# Altium schematic sheet RemoteSch_V2.SchDoc: Remote Controller
size A3; Author: Neil Patil, Harris Tomy; Organization: The University of Auckland; Address1: Building 405; Address2: 20 Symonds Street; Address3: Auckland, 1010; Address4: New Zealand; Revision: 1R0; SheetNumber: 1; SheetTotal: ?
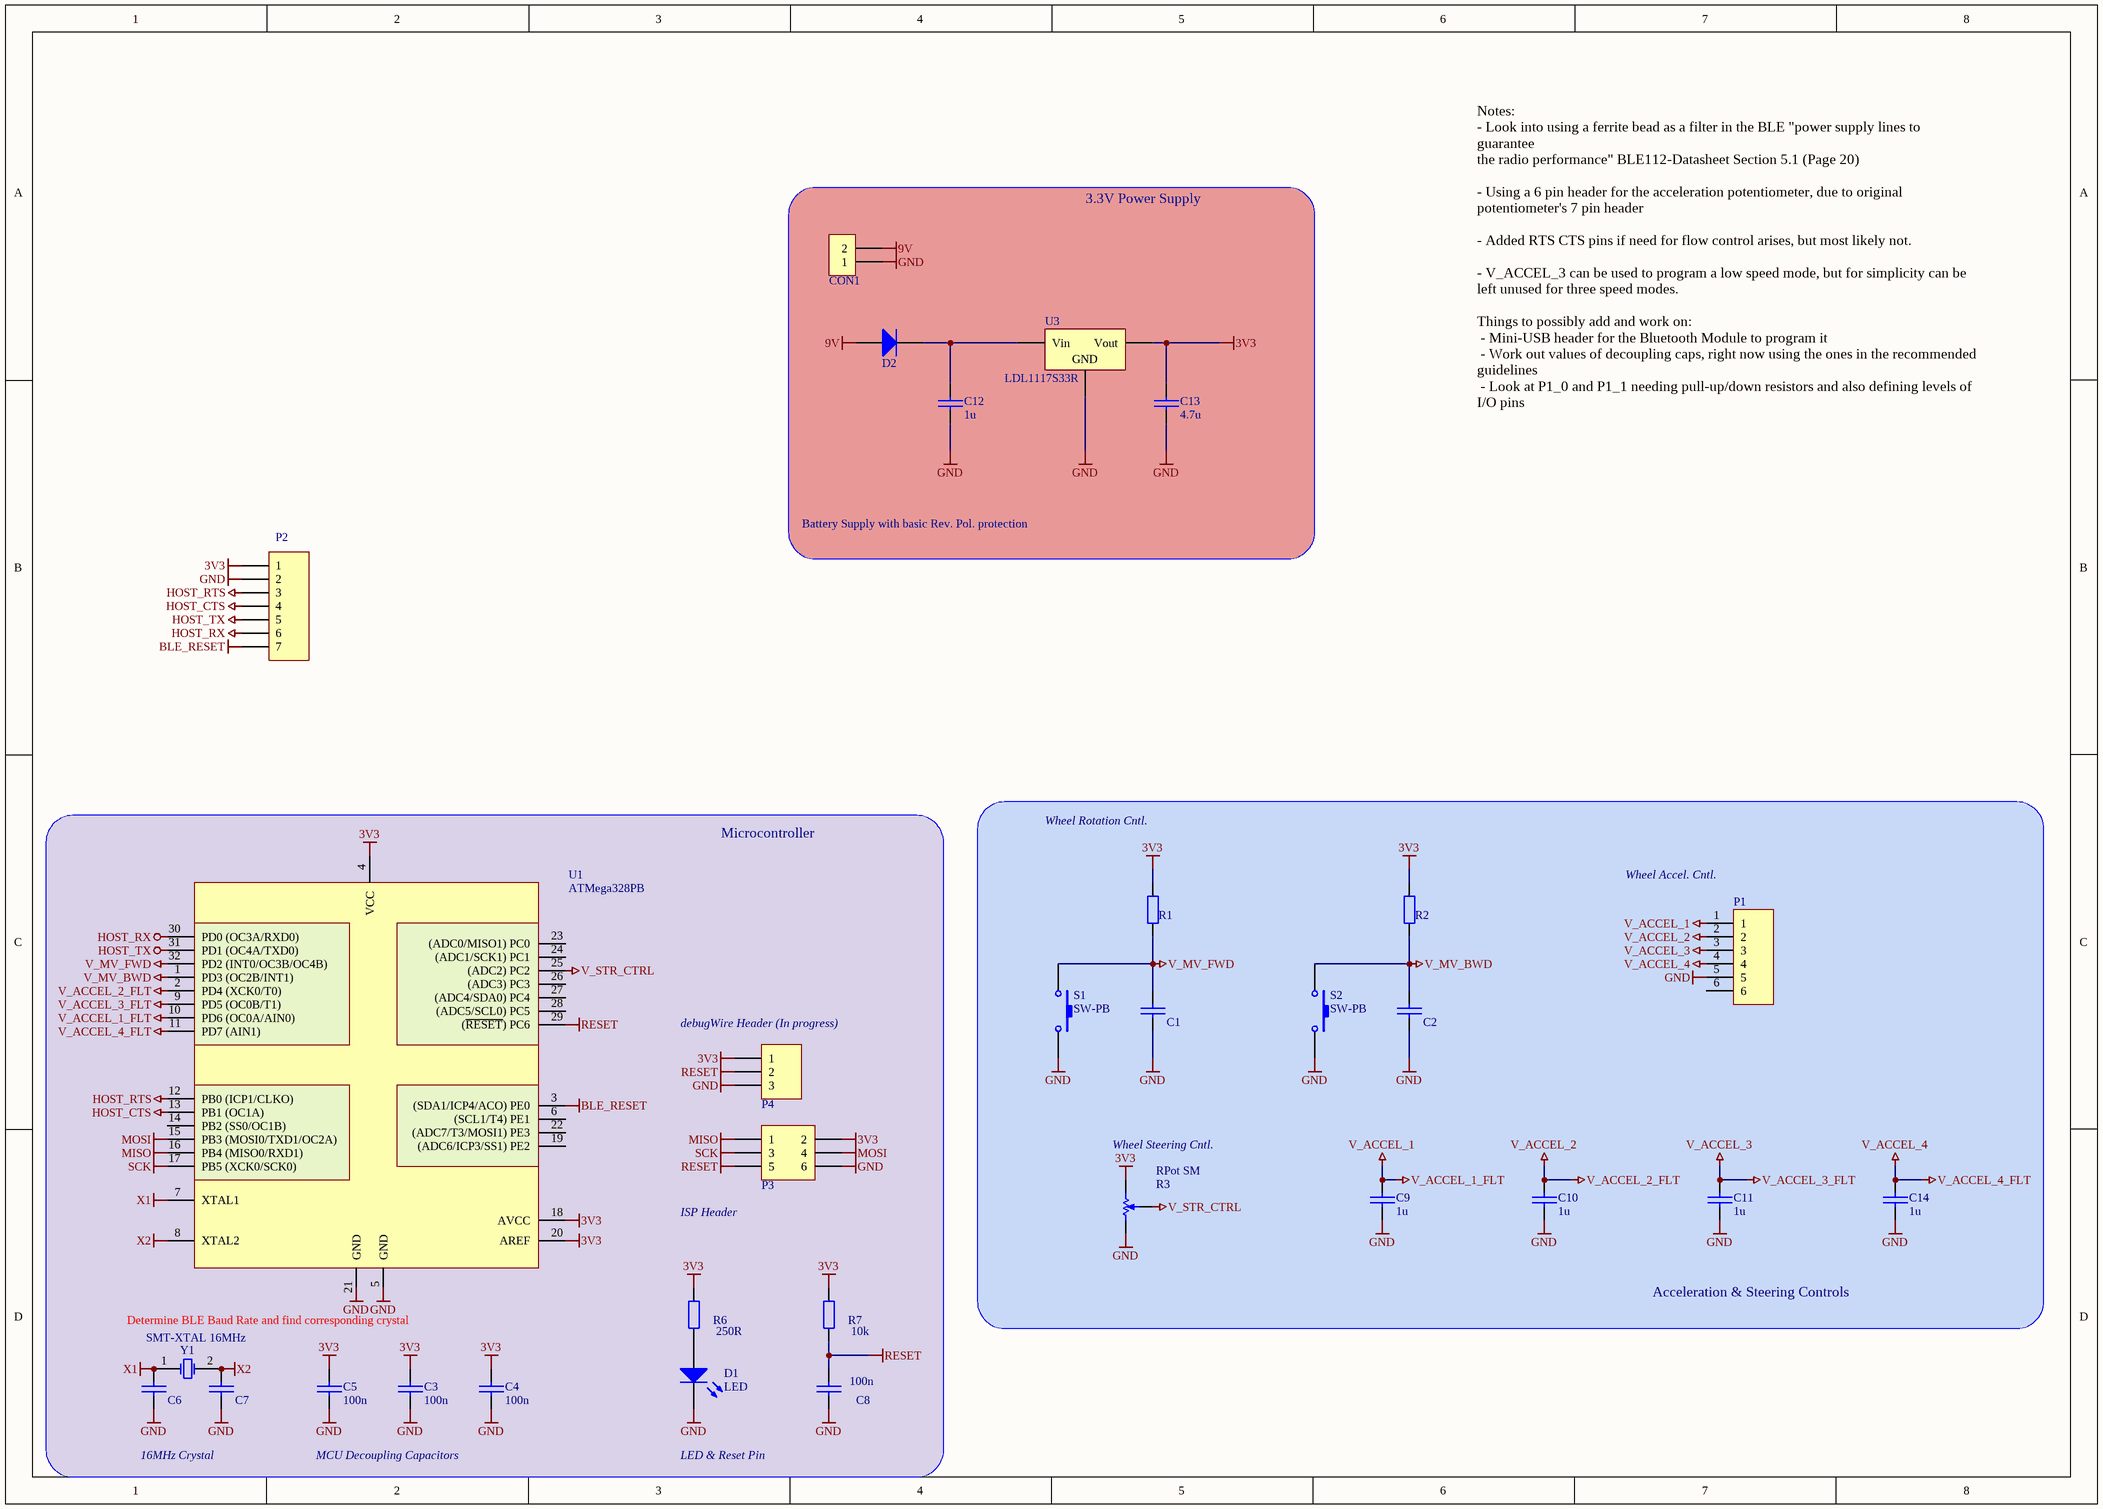
[diagram p0: RemoteSch_V2.SchDoc]

## Parts
C1  Capacitor 0805  [C0805]  (value not drawn)
C2  Capacitor 0805  [C0805]  (value not drawn)
C3  100n  [C1206]
C4  100n  [C1206]
C5  100n  [C1206]
C6  CCAP1210  [C1210]  (value not drawn)
C7  CCAP1210  [C1210]  (value not drawn)
C8  100n  [C1210]
C9  1u  [C0805]
C10  1u  [C0805]
C11  1u  [C0805]
C12  1u  [C1210]
C13  4.7u  [C1210]
C14  1u  [C0805]
CON1  Header 2X1  [HDR2X1_2P54]  (value not drawn)
D1  LED  [R0805]
D2  Diode  [DAX4]  (value not drawn)
P1  Header 6X1  [HDR6X1_2P54]  (value not drawn)
P2  Header 7  [HDR1X7]  (value not drawn)
P3  HDR3X2  [HDR2X3_2P54]  (value not drawn)
P4  Header 3  [HDR1X3]  (value not drawn)
R1  Resistor 0805  [R0805]  (value not drawn)
R2  Resistor 0805  [R0805]  (value not drawn)
R3  RPot SM  [POT4MM-2]
R6  250R  [R1206]
R7  10k  [R1206]
S1  SW-PB  [SPST-2]
S2  SW-PB  [SPST-2]
U1  ATMega328PB  [TQFP32]
U3  LDL1117S33R  [SOT223L]
Y1  SMT-XTAL 16MHz  [HC49-US]

## Blocks framed on the sheet
3.3V Power Supply: C12 C13 CON1 D2 U3
Microcontroller: C3-C8 D1 P3 P4 R6 R7 U1 Y1
Acceleration & Steering Controls: C1 C2 C9-C11 C14 P1 R1-R3 S1 S2

## Nets
3V3: C3.2 C4.2 C5.2 C13.2 P2.1 P3.2 P4.1 R1.1 R2.1 R3.CW(+) R6.2 R7.2 U1.4(VCC) U1.18(AVCC) U1.20(AREF) U3.2(Vout)
9V: CON1.2 D2.1
BLE_RESET: P2.7 U1.3((SDA1/ICP4/ACO)_PE0)
GND: C1.1 C2.1 C3.1 C4.1 C5.1 C6.1 C7.1 C8.1 C9.1 C10.1 C11.1 C12.1 C13.1 C14.1 CON1.1 D1.2(K) P1.5 P2.2 P3.6 P4.3 R3.CCW(-) S1.2 S2.2 U3.1(GND)
HOST_CTS: P2.4 U1.13(PB1_(OC1A))
HOST_RTS: P2.3 U1.12(PB0_(ICP1/CLKO))
HOST_RX: P2.6 U1.30(PD0_(OC3A/RXD0))
HOST_TX: P2.5 U1.31(PD1_(OC4A/TXD0))
MISO: P3.1 U1.16(PB4_(MISO0/RXD1))
MOSI: P3.4 U1.15(PB3_(MOSI0/TXD1/OC2A))
RESET: C8.2 P3.5 P4.2 R7.1 U1.29((~{RESET})_PC6)
SCK: P3.3 U1.17(PB5_(XCK0/SCK0))
V_ACCEL_1: C9.2 P1.1 U1.10(PD6_(OC0A/AIN0))  [also labelled V_ACCEL_1_FLT]
V_ACCEL_2: C10.2 P1.2 U1.2(PD4_(XCK0/T0))  [also labelled V_ACCEL_2_FLT]
V_ACCEL_3: C11.2 P1.3 U1.9(PD5_(OC0B/T1))  [also labelled V_ACCEL_3_FLT]
V_ACCEL_4: C14.2 P1.4 U1.11(PD7_(AIN1))  [also labelled V_ACCEL_4_FLT]
V_MV_BWD: C2.2 R2.2 S2.1 U1.1(PD3_(OC2B/INT1))
V_MV_FWD: C1.2 R1.2 S1.1 U1.32(PD2_(INT0/OC3B/OC4B))
V_STR_CTRL: R3.W U1.25((ADC2)_PC2)
X1: C6.2 U1.7(XTAL1) Y1.1(OSC1)
X2: C7.2 U1.8(XTAL2) Y1.2(OSC2)
NetC12_2: C12.2 D2.2 U3.3(Vin)
NetD1_1: D1.1(A) R6.1

Not connected (* = marked no-connect by the designer): P1 6; U1 5(GND) 6((SCL1/T4)_PE1) 14(PB2_(SS0/OC1B)) 19((ADC6/ICP3/SS1)_PE2) 21(GND) 22((ADC7/T3/MOSI1)_PE3) 23((ADC0/MISO1)_PC0) 24((ADC1/SCK1)_PC1) 26((ADC3)_PC3) 27((ADC4/SDA0)_PC4) 28((ADC5/SCL0)_PC5)

## Notes on the sheet
- Notes:
  - Look into using a ferrite bead as a filter in the BLE "power supply lines to guarantee
  the radio performance" BLE112-Datasheet Section 5.1 (Page 20)
  - Using a 6 pin header for the acceleration potentiometer, due to original potentiometer's 7 pin header
  - Added RTS CTS pins if need for flow control arises, but most likely not.
  - V_ACCEL_3 can be used to program a low speed mode, but for simplicity can be left unused for three speed modes.
  Things to possibly add and work on:
  - Mini-USB header for the Bluetooth Module to program it
  - Work out values of decoupling caps, right now using the ones in the recommended guidelines
  - Look at P1_0 and P1_1 needing pull-up/down resistors and also defining levels of I/O pins
- Battery Supply with basic Rev. Pol. protection
- Wheel Rotation Cntl.
- (near P1) Wheel Accel. Cntl.
- (near P4) debugWire Header (In progress)
- (near R3) Wheel Steering Cntl.
- (near P3) ISP Header
- Determine BLE Baud Rate and find corresponding crystal
- 16MHz Crystal
- MCU Decoupling Capacitors
- LED & Reset Pin
- Labels drawn without touching a wire or pin: GND
- Title:
- Author:
- Date:
- Time:
- Revision:
- Sheet
- of
- File:

## Library data of the parts
C1 C2 C9-C11 C14 = CCAP0805
C3-C5 = Cap CER Decoup C3216C0G2A104J160AC: CAP CER 0.1UF 100V C0G 1206; Manufacturer: TDK Corporation; Type: Surface mount; Value: 100nF/100V; Supplier 1: RSComponents; Supplier Part Number 1: 1795799; MPN: C3216C0G2A104J160AC; Supplier 2: Element14; Part Description: CAP CER 0.1UF 100V C0G 1206; Supplier Part Number 4: 810-C3216C0G2A104J6C; Supplier Part Number 3: 445-172677-1-ND; Supplier Part Number 2: 2906828; Supplier 4: Mouser; Supplier 3: Digi-Key
C6 C7 = CCAP1210: Type: Surface Mount; Value: 18p; MPN: ?; Part Description: ?
C8 = CCAP1210
C12 C13 = Cap CER HF DC-Link CL32B225KCJSNNE: CAP CER 2.2UF 100V X7R 1210; Manufacturer: AVX Corporation; Type: Surface mount; Value: 2200nF/100V; MPN: CL32B225KCJSNNE; Part Description: CAP CER 2.2UF 100V X7R 1210; Supplier 1: Digi-Key; Supplier Part Number 1: 1276-3362-1-ND; Supplier 2: Arrow
CON1 = HDR2X1
P1 = HDR6X1: Header, 6-Pin; LatestRevisionDate: 17-Jul-2002; LatestRevisionNote: Re-released for DXP Platform.; Publisher: Altium Limited
P2 = Header 7: Header, 7-Pin; LatestRevisionDate: 17-Jul-2002; LatestRevisionNote: Re-released for DXP Platform.; Publisher: Altium Limited
P3 = HDR3X2: Header, 3-Pin, Dual row
P4 = Header 3: Header, 3-Pin; LatestRevisionDate: 17-Jul-2002; LatestRevisionNote: Re-released for DXP Platform.; Publisher: Altium Limited
R1 R2 = RES0805
R3 = RPot SM: Square Trimming Potentiometer; Published: 17-Dec-2003; DatasheetVersion: Oct-2003; PackageReference: POT4MM-2; Publisher: Altium Limited; PackageDescription: Square Trimming Potentiometer; ComponentLink1Description: Manufacturer Link; ComponentLink1URL: http://bourns.com/2/search.html
R6 R7 = RES1206
S1 S2 = SW-PB: Switch; Published: 24-Mar-1999; LatestRevisionDate: 17-Jul-2002; LatestRevisionNote: Re-released for DXP Platform.; PackageReference: SPST-2; Publisher: Altium Limited; PackageDescription: Switch; 2 Leads
U1 = ATMega328PB: IC MCU 8BIT 32KB FLASH 32TQFP; Supplier 1: Digi-Key; Supplier Part Number 1: ATMEGA328PB-AU-ND; Supplier 2: Digikey; Supplier Part Number 2: ATMEGA328PB-AU-ND
U3 = LDO LDL1117S33R: IC REG LINEAR 3.3V 1.2A SOT223; Manufacturer: STMicroelectronics; Value: 3.3V/1.2A; MPN: LDL1117S33R; Supplier 1: Element14; Type: Surface mount; Part Description: IC REG LINEAR 3.3V 1.2A SOT223; Supplier Part Number 3: 511-LDL1117S33R; Supplier Part Number 2: 497-17239-1-ND; Supplier Part Number 1: 2729708; Supplier 3: Mouser; Supplier 2: Digi-Key
Y1 = TXC9C-16_XTAL_SMT: 9C-16.000MAAJ-T crystal 16.0000MHZ 18PF SMD; Manufacturer: TXC CORPORATION; Frequency Stability: ±30ppm; Operating Mode: Fundamental; Supplier 1: Digi-Key; Manufacturer Part Number: 9C-16.000MAAJ-T; RoHS: RoHS Compliant; Category: Crystals, Oscillators, Resonators; Stock 1: 11514; Pricing 1: 1=0.75, 10=0.628, 50=0.5656, 100=0.5026, 500=0.47744 (NZD); Packaging: Cut Tape (CT); Part Status: Active; Type: MHz Crystal; Frequency Tolerance: ±30ppm; Load Capacitance: 18pF; Operating Temperature: -20°C ~ 70°C; Ratings: -; Mounting Type: Surface Mount; Package / Case: HC-49/US; Size / Dimension: 0.449" L x 0.189" W (11.40mm x 4.80mm); Height - Seated (Max): 0.161" (4.10mm); ComponentLink1URL: http://www.txccorp.com/download/products/quartz_crystals/2015TXC_9C_32.pdf; ComponentLink1Description: http://www.txccorp.com/download/products/quartz_crystals/2015TXC_9C_32.pdf; Supplier Part Number 1: 887-1059-1-ND